# EAGLE design saw-filter-adapter (EAGLE 9.6.2)
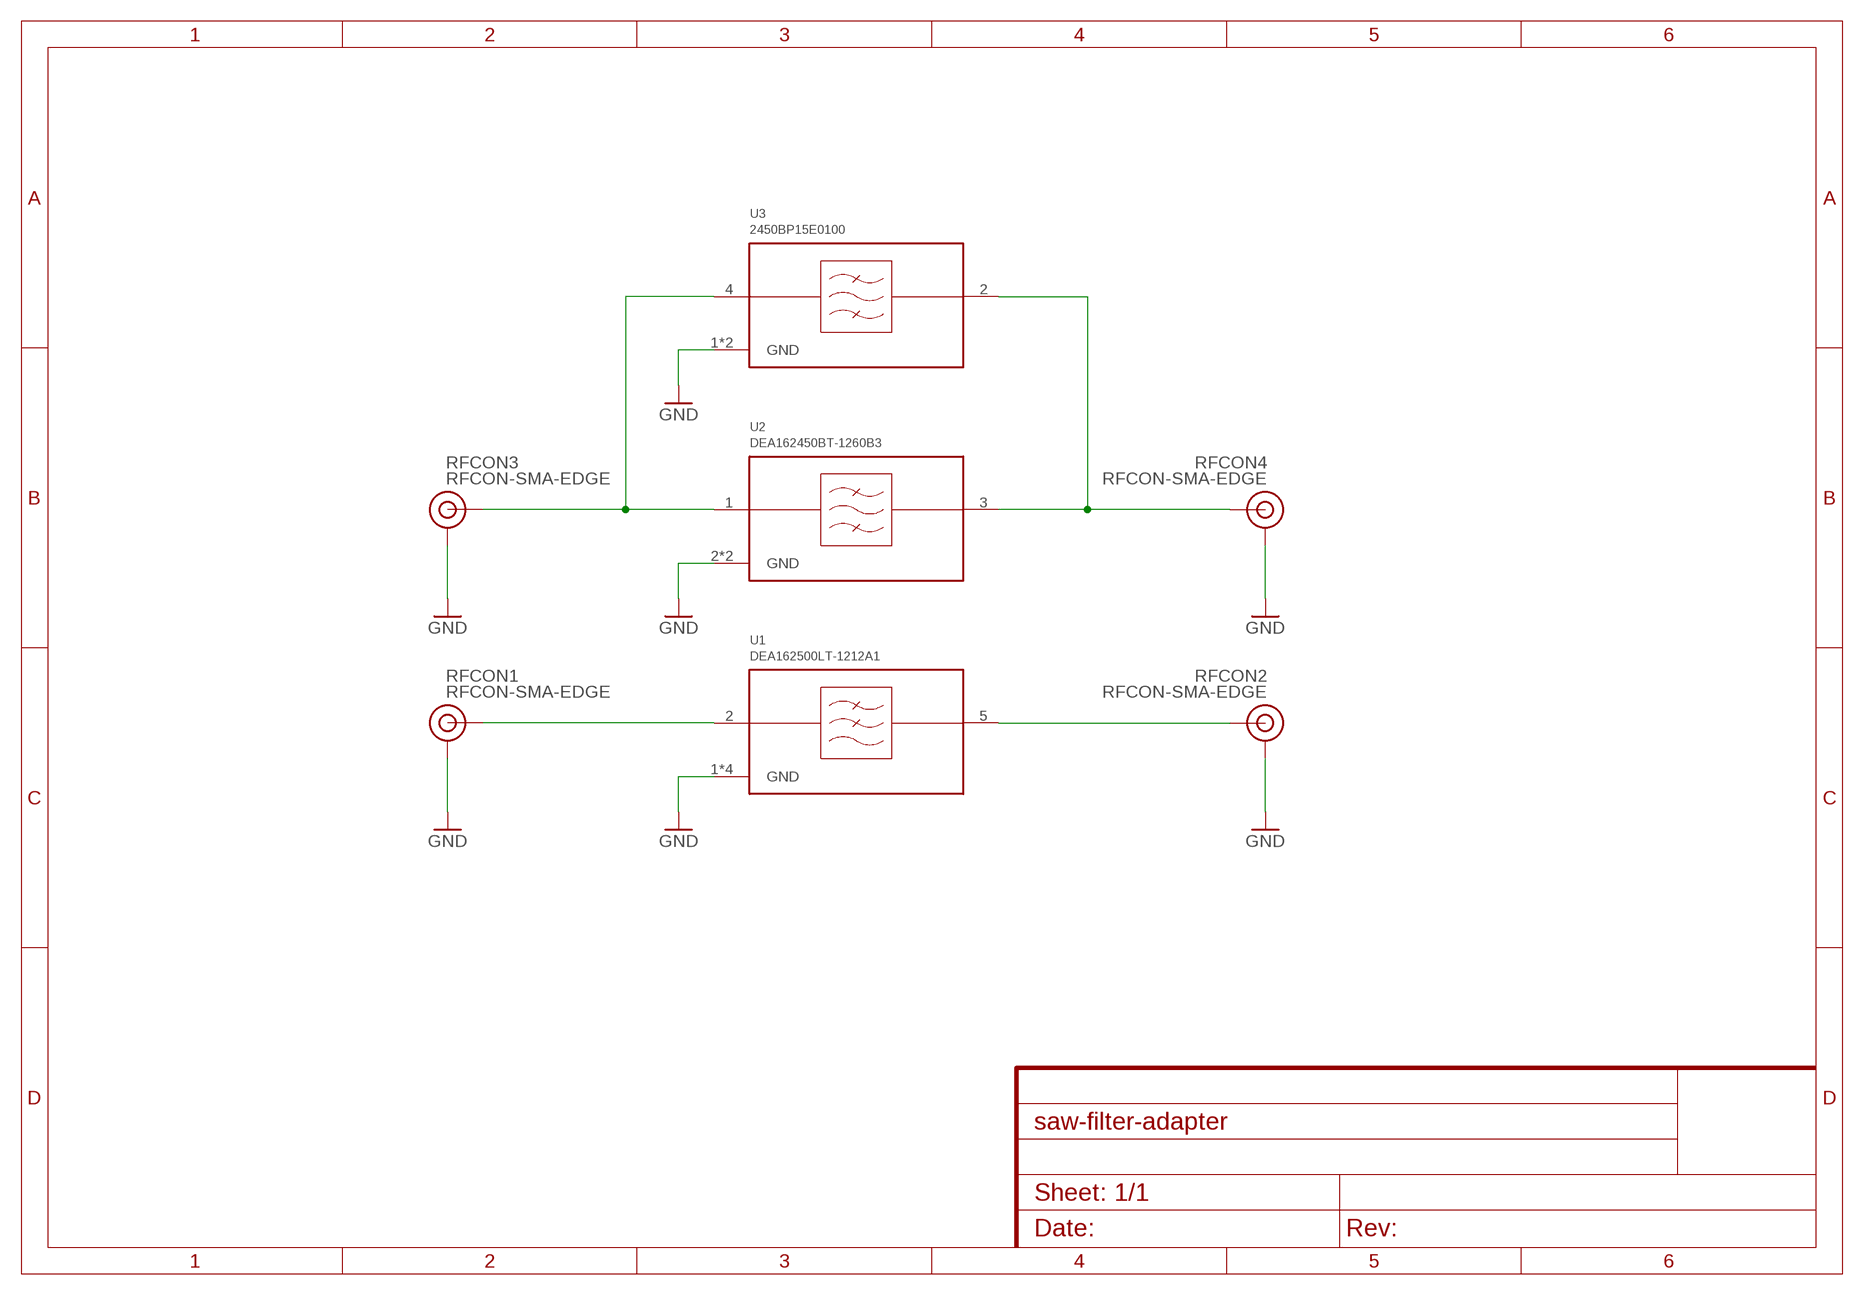
[diagram p0: schematic, sheet 1]

## Parts
RFCON1  RFCON-SMA-EDGE  [SMA-EDGE]
RFCON2  RFCON-SMA-EDGE  [SMA-EDGE]
RFCON3  RFCON-SMA-EDGE  [SMA-EDGE]
RFCON4  RFCON-SMA-EDGE  [SMA-EDGE]
U1  DEA162500LT-1212A1  [DEA162500LT-1212A1]
U2  DEA162450BT-1260B3  [DEA162450BT-1260B3]
U3  2450BP15E0100  [2450BP15E0100]

## Nets
GND: RFCON1.GND@0(GND) RFCON1.GND@1(GND) RFCON1.GND@2(GND) RFCON1.GND@3(GND) RFCON2.GND@0(GND) RFCON2.GND@1(GND) RFCON2.GND@2(GND) RFCON2.GND@3(GND) RFCON3.GND@0(GND) RFCON3.GND@1(GND) RFCON3.GND@2(GND) RFCON3.GND@3(GND) RFCON4.GND@0(GND) RFCON4.GND@1(GND) RFCON4.GND@2(GND) RFCON4.GND@3(GND) U1.1(GND) U1.3(GND) U1.4(GND) U1.6(GND) U2.2(GND) U2.4(GND) U3.1(GND) U3.3(GND)
N$1: RFCON1.SIG(SIGNAL) U1.2(RFIN)
N$2: RFCON2.SIG(SIGNAL) U1.5(RFOUT)
N$5: RFCON4.SIG(SIGNAL) U2.3(RFOUT) U3.2(RFOUT)
N$6: RFCON3.SIG(SIGNAL) U2.1(RFIN) U3.4(RFIN)

## Library data of the parts
RFCON1-RFCON4 = RF Connector:RFCON
U1 = TDK:DEA162500LT-1212A1
U2 = TDK:DEA162450BT-1260B3
U3 = Generic Filter:2450BP15E0100

## Board
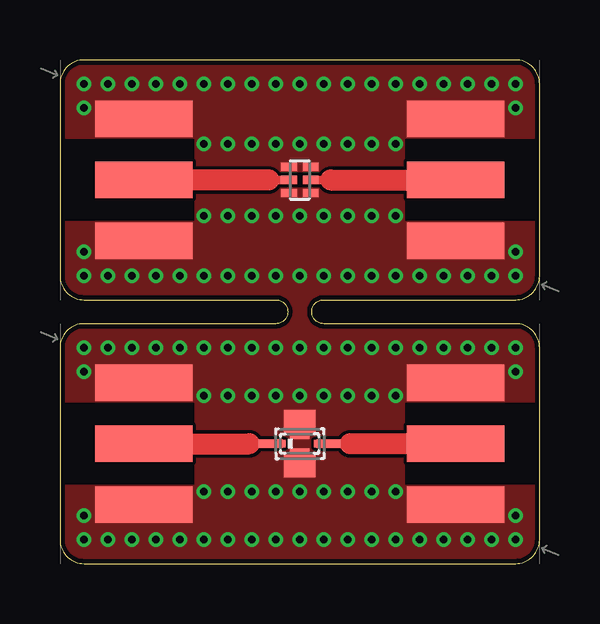
[diagram p1: board, top side]
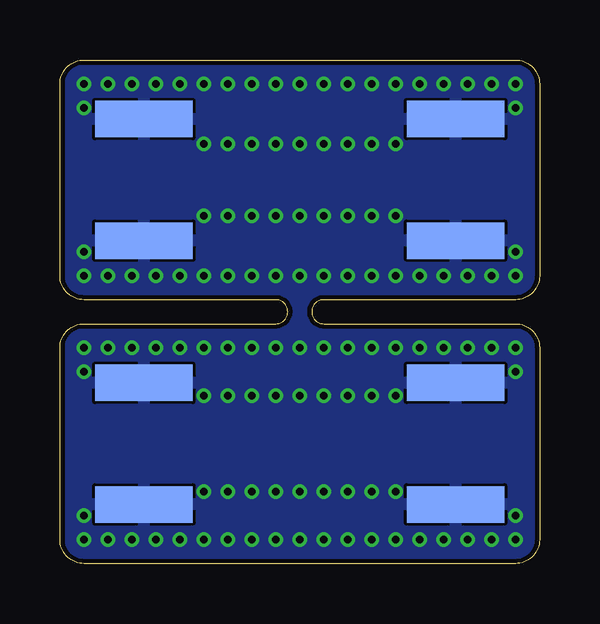
[diagram p2: board, bottom side, seen from below]

Size 20 x 21 mm. Coordinates in mm from the lower left corner, seen from the top.
Outline: 0,9 0,1 arc90 1,0 19,0 arc90 20,1 20,9 arc90 19,10 11,10 arc-90 10.5,10.5 arc-90 11,11 19,11 arc90 20,12 20,20 arc90 19,21 1,21 arc90 0,20 0,12 arc90 1,11 9,11 arc-90 9.5,10.5 arc-90 9,10 1,10 arc90 0,9
Copper layers (1*16): Top 0.035mm / dielectric 1.6mm / Bottom 0.035mm
Design rules "jlcpcb_2layer": minimum track width 5mil, minimum drill 0.3mm, track to track 5mil, track to pad 5mil, pad to pad 5mil, via to via 5mil, smd to smd 5mil, copper to edge 0.2mm, drill to drill 5mil, minimum pad ring 0.13mm, minimum via ring 0.1mm, stop-mask expansion 0.04mm, vias tented up to drill 10mm, thermal gap 5mil

### Footprints (pad centres in the part's own frame; a part is rotated, then mirrored left to right if it is on the bottom)
SMA-EDGE = smd 1.524 x 4.064: GND@0 -2.54,0; GND@1 2.54,0; SIG 0,0 | smd 1.524 x 4.064 bottom: GND@2 -2.54,0; GND@3 2.54,0
DEA162500LT-1212A1 = smd 0.35 x 0.65: 1 0.55,0.45; 2 0,0.45; 3 -0.55,0.45; 4 -0.55,-0.45; 5 0,-0.45; 6 0.55,-0.45
DEA162450BT-1260B3 = smd 0.5 x 0.3: 1 -0.85,0; 3 0.85,0 | smd 0.8 x 0.5: 2 0,-0.45; 4 0,0.45
2450BP15E0100 = smd 1.3 x 1: 1 0,0.9; 3 0,-0.9 | smd 1 x 0.35: 2 1.2,0; 4 -1.2,0

### Placement (x,y rotation side)
RFCON1  16.5,16 90 top
RFCON2  3.5,16 270 top
RFCON3  3.5,5 270 top
RFCON4  16.5,5 90 top
U1  10,16 270 top
U2  10,5 0 top
U3  10,5 0 top

### Tracks (layer width: path | path; a pad name or v marks a point on that pad's centre or on a via)
GND  (via drill 0.3)
  other vias: 6,3 7,3 8,3 9,3 10,3 11,3 12,3 13,3 14,3 6,7 7,7 8,7 9,7 10,7 11,7 12,7 13,7 14,7 10,12 11,12 12,12 13,12 14,12 15,12 16,12 17,12 18,12 6,14.5 7,14.5 8,14.5 9,14.5 10,14.5 11,14.5 12,14.5 13,14.5 14,14.5 6,17.5 7,17.5 8,17.5 9,17.5 10,17.5 11,17.5 12,17.5 13,17.5 14,17.5 19,13 19,12 1,12 2,12 3,12 4,12 5,12 6,12 7,12 8,12 9,12 1,13 19,20 18,20 17,20 16,20 15,20 14,20 13,20 12,20 11,20 19,19 10,20 9,20 8,20 7,20 6,20 5,20 4,20 3,20 2,20 1,20 1,19 1,1 2,1 3,1 4,1 5,1 6,1 7,1 8,1 9,1 1,2 10,1 11,1 12,1 13,1 14,1 15,1 16,1 17,1 18,1 19,1 19,2 19,9 18,9 17,9 16,9 15,9 14,9 13,9 12,9 11,9 19,8 10,9 9,9 8,9 7,9 6,9 5,9 4,9 3,9 2,9 1,9 1,8
  pour Top (no thermals): -1,22 21,22 21,-1 -1,-1
  pour Bottom: -2,23 22,23 22,-2 -2,-2
N$1
  Top 0.35: U1.2 11.3,16
  Top 0.885: 11.3,16 RFCON1.SIG
N$2
  Top 0.35: U1.5 8.7,16
  Top 0.885: 8.7,16 RFCON2.SIG
N$5
  Top 0.305: 12.1,5 U3.2 U2.3
  Top 0.885: RFCON4.SIG 12.1,5
N$6
  Top 0.305: 7.9,5 U3.4 U2.1
  Top 0.885: RFCON3.SIG 7.9,5